# Altium schematic sheet Collision_avoidance.SchDoc
size A
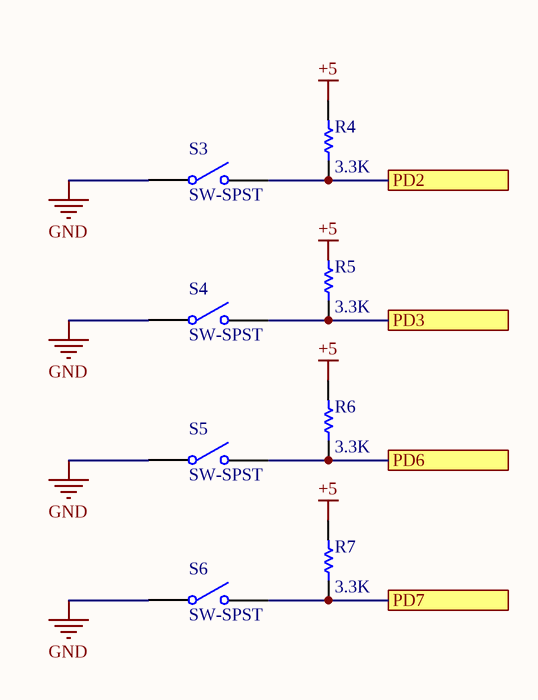
[diagram p0: Collision_avoidance.SchDoc]

## Parts
R4  value 3.3K  [AXIAL-0.3]  (hidden comment: Res1)
R5  value 3.3K  [AXIAL-0.3]  (hidden comment: Res1)
R6  value 3.3K  [AXIAL-0.3]  (hidden comment: Res1)
R7  value 3.3K  [AXIAL-0.3]  (hidden comment: Res1)
S3  SW-SPST  [SPST-2]
S4  SW-SPST  [SPST-2]
S5  SW-SPST  [SPST-2]
S6  SW-SPST  [SPST-2]

## Ports
PD2, PD3, PD6, PD7

## Nets
+5: R4.2 R6.2 R7.2
GND: S3.1(COMMON) S4.1(COMMON) S5.1(COMMON) S6.1(COMMON)
PD2: R4.1 S3.2(NO) ; port PD2
PD3: R5.1 S4.2(NO) ; port PD3
PD6: R6.1 S5.2(NO) ; port PD6
PD7: R7.1 S6.2(NO) ; port PD7

Not connected (* = marked no-connect by the designer): R5 2

## Notes on the sheet
- Labels drawn without touching a wire or pin: +5

## Library data of the parts
R4-R7 = Res1: Resistor; Published: 8-Jun-2000; LatestRevisionDate: 17-Jul-2002; LatestRevisionNote: Re-released for DXP Platform.; PackageReference: AXIAL-0.3; Publisher: Altium Limited; PackageDescription: Axial Device, Thru-Hole; 2 Leads; 0.3 in Pin Spacing
S3-S6 = SW-SPST: Single-Pole, Single-Throw Switch; Published: 24-Mar-1999; LatestRevisionDate: 17-Jul-2002; LatestRevisionNote: Re-released for DXP Platform.; PackageReference: SPST-2; Publisher: Altium Limited; PackageDescription: Switch; 2 Leads